# EAGLE schematic Model train - Speedometer - Receiver (EAGLE 6.5.0)
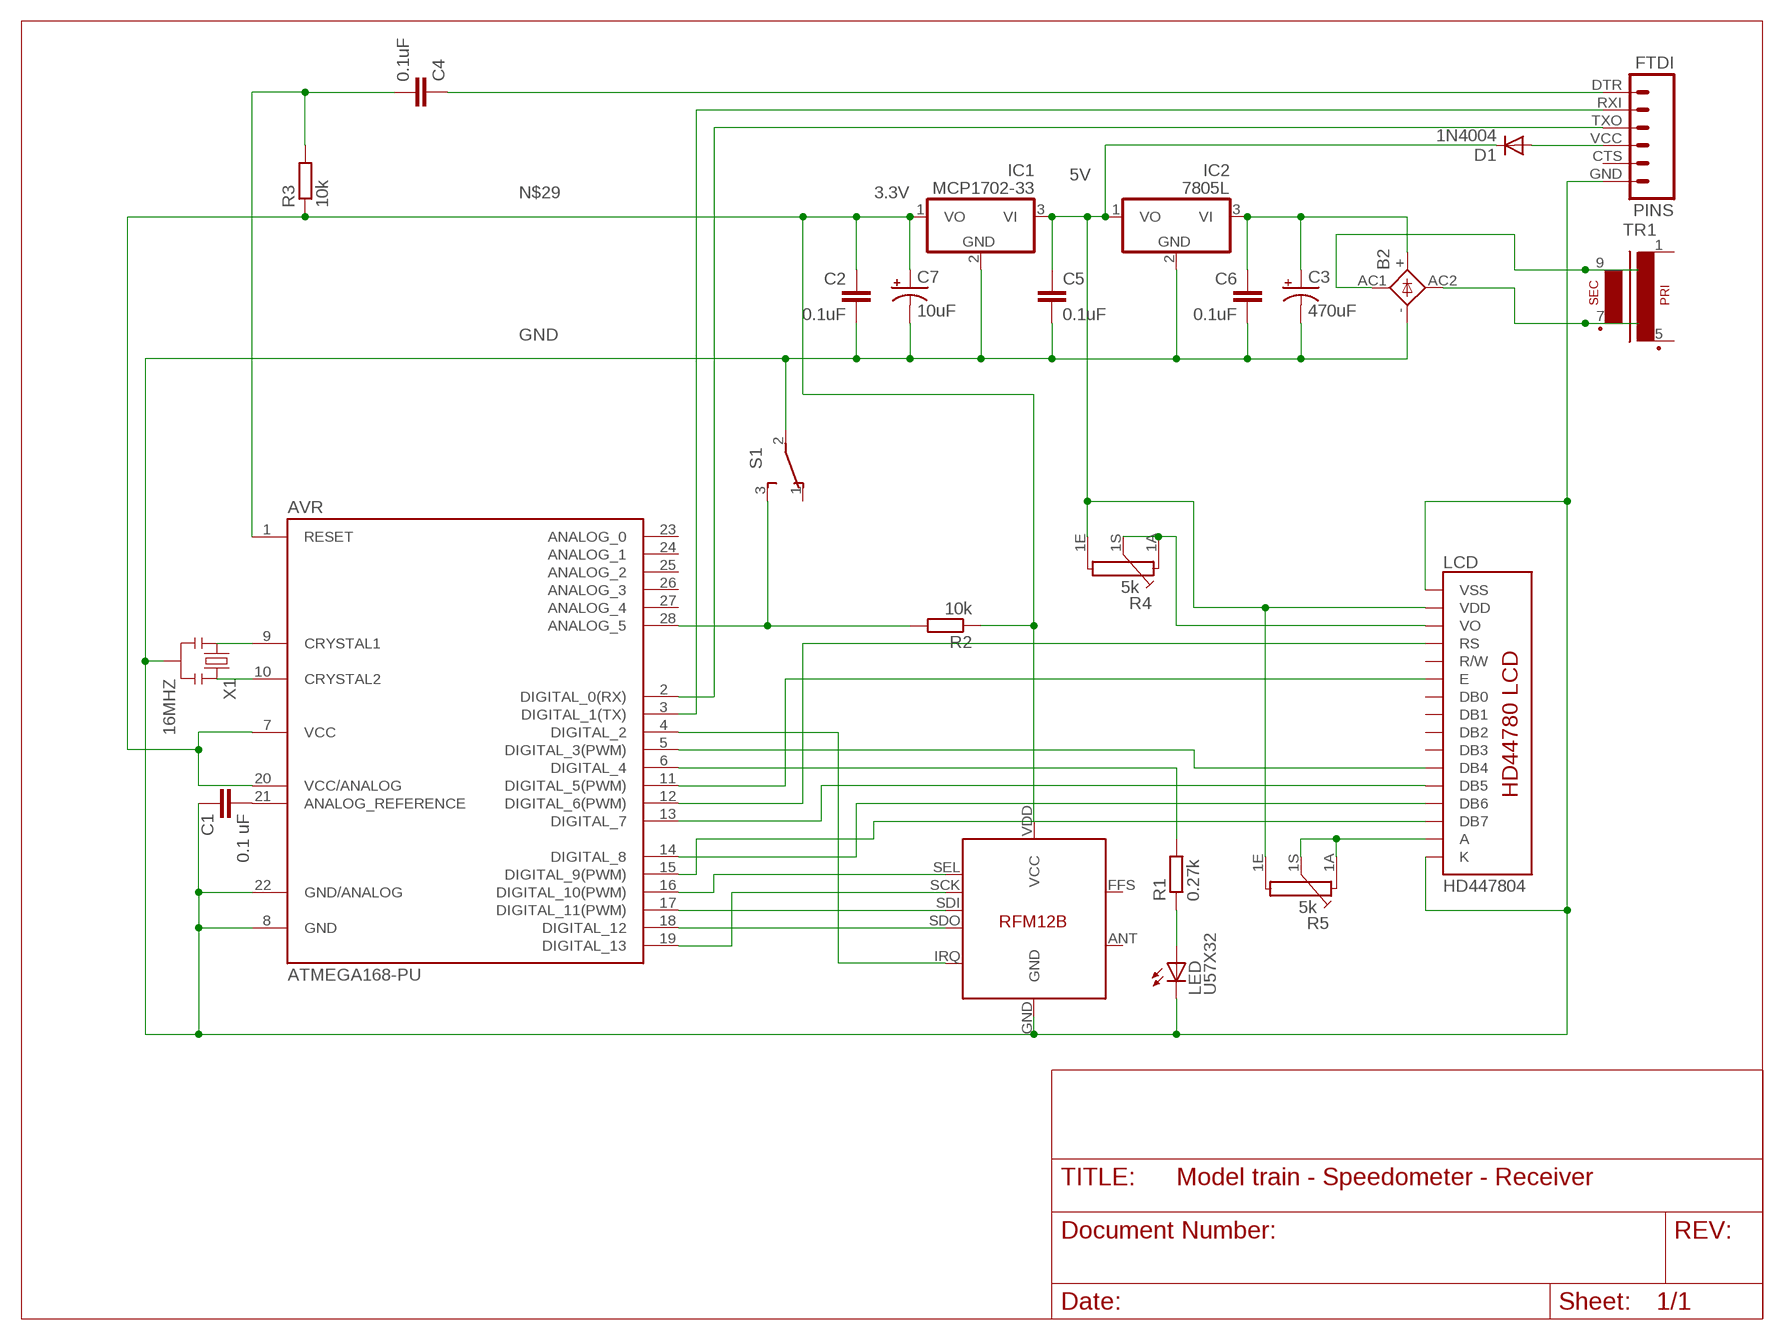
[diagram p0: schematic, sheet 1]

## Parts
AVR  ATMEGA168-PU  [DIL28-3]
B2  1KAB  [1KAB]
C1  0.1 uF  C-EU025-025X050  [C025-025X050]
C2  0.1uF  C-EU025-025X050  [C025-025X050]
C3  470uF  CAP_POL  [CPOL-RADIAL-100UF-25V-150MIL]
C4  0.1uF  C-EU025-025X050  [C025-025X050]
C5  0.1uF  C-EU025-025X050  [C025-025X050]
C6  0.1uF  C-EU025-025X050  [C025-025X050]
C7  10uF  CAP_POL  [CPOL-RADIAL-100UF-25V-150MIL]
D1  1N4004  [DO41-10]
IC1  MCP1702-33  7805L  [TO92]
IC2  7805L  [TO92]
LCD  HD447804  LCD-HD447804-HOLES16X2-4-HOLES  [LCD-16X2-4HOLES]
LED  U57X32  [U57X32]
PINS  FTDI  FTDI_BASICPTH  [FTDI_BASIC]
R1  0.27k  R-EU_0204/2V  [0204V]
R2  10k  R-EU_0204/2V  [0204V]
R3  10k  R-EU_0204/2V  [0204V]
R4  5k  PC16S  [PC16S]
R5  5k  PC16S  [PC16S]
S1  TL36YO  [TL3XYO]
TR1  EI38-1  [EI38-1]
U$2  RFM12B  [RFM12B]
X1  16MHZ  RESONATOR16MHZ  [RESONATOR-SMD]

## Nets
3.3V: C2.1 C7.1(+) IC1.1(VO)
5V: C5.1 D1.C IC1.3(VI) IC2.1(VO) LCD.2(VDD) R4.1E R5.1E
GND: AVR.8(GND) AVR.22(GND/ANALOG) B2.- C1.1 C2.2 C3.2(-) C5.2 C6.2 C7.2(-) IC1.2(GND) IC2.2(GND) LCD.1(VSS) LCD.16(K) LED.K(C) PINS.GND S1.2(P) U$2.GND X1.2
N$1: AVR.4(DIGITAL_2) U$2.IRQ
N$2: AVR.16(DIGITAL_10(PWM)) U$2.SEL
N$3: AVR.19(DIGITAL_13) U$2.SCK
N$4: AVR.17(DIGITAL_11(PWM)) U$2.SDI
N$5: AVR.18(DIGITAL_12) U$2.SDO
N$6: AVR.9(CRYSTAL1) X1.1
N$7: AVR.10(CRYSTAL2) X1.3
N$8: AVR.28(ANALOG_5) R2.2 S1.3(S)
N$9: AVR.6(DIGITAL_4) R1.2
N$10: AVR.21(ANALOG_REFERENCE) C1.2
N$11: AVR.1(RESET)
N$12: AVR.3(DIGITAL_1(TX)) PINS.RXI
N$13: AVR.2(DIGITAL_0(RX)) PINS.TXO
N$14: LED.A R1.1
N$15: B2.AC2 TR1.7(S3)
N$16: D1.A PINS.VCC
N$17: AVR.12(DIGITAL_6(PWM)) LCD.4(RS)
N$18: B2.+ C3.1(+) C6.1 IC2.3(VI)
N$19: C4.2 R3.2
N$20: AVR.11(DIGITAL_5(PWM)) LCD.6(E)
N$21: B2.AC1 TR1.9(S4)
N$22: AVR.5(DIGITAL_3(PWM)) LCD.11(DB4)
N$23: AVR.13(DIGITAL_7) LCD.12(DB5)
N$24: AVR.14(DIGITAL_8) LCD.13(DB6)
N$25: C4.1 PINS.DTR
N$26: AVR.15(DIGITAL_9(PWM)) LCD.14(DB7)
N$27: LCD.3(VO) R4.1A R4.1S
N$28: LCD.15(A) R5.1A R5.1S
N$29: AVR.7(VCC) AVR.20(VCC/ANALOG) R2.1 R3.1 U$2.VDD(VCC)
Unconnected: AVR.23(ANALOG_0) AVR.24(ANALOG_1) AVR.25(ANALOG_2) AVR.26(ANALOG_3) AVR.27(ANALOG_4) LCD.5(R/W) LCD.7(DB0) LCD.8(DB1) LCD.9(DB2) LCD.10(DB3) PINS.CTS S1.1(O) TR1.1 TR1.5(P2) U$2.ANT U$2.FFS

## Library data of the parts
AVR = Arduino-AVR:ATMEGA168-PU
B2 = rectifier:1KAB: RECTIFIER grid 5,08 x 5,08 mm
C1 C2 C4-C6 = rcl:C-EU: CAPACITOR, European symbol
C3 C7 = SteveMarple:CAP_POL: Capacitor Polarized These are standard SMD and PTH capacitors. Normally 10uF, 47uF, and 100uF in electrolytic and tantalum varieties. Always verify the external diameter of the through hole cap, it varies with capacity, voltage, and manufacturer. The EIA devices should be standard.
D1 = diode:1N4004: DIODE general purpose rectifier, 1 A
IC1 IC2 = linear:78*: Positive VOLTAGE REGULATOR Source: http://cache.national.com/ds/LM/LM78L05.pdf http://www.fairchildsemi.com/ds/LM/LM7805.pdf
LCD = HD44780LCD:LCD-HD44780
LED = led:U57X32: LED rectangle, 5.7 x 3.2 mm
PINS = SparkFun-Connectors:FTDI_BASIC: FTDI Basic header with labels
R1-R3 = resistor:R-EU_: RESISTOR, European symbol
R4 R5 = piher:PC16S: POTENTIOMETER single carbon potentiometer, 16 mm, S3ROH; OC_FARNELL: 4452940; OC_NEWARK: unknown
S1 = switch:TL36YO: TINY SWITCH ON - ON Source: http://www2.produktinfo.conrad.com/datenblaetter/700000-724999/705152-da-01-de-Subminiaturschalter_TL_36YO.pdf
TR1 = trafo:EI38-1: TRANSFORMER 1 primary winding, 1 secondary winding ERA
U$2 = JeeParts:RFM12B
X1 = SparkFun-FreqCtrl:RESONATOR: Resonator Small SMD resonator. Used, eg, on the Arduino Pro/ Pro Mini boards. 8MHz- XTAL-08895 16MHz- XTAL-08900; PROD_ID: XTAL-08900